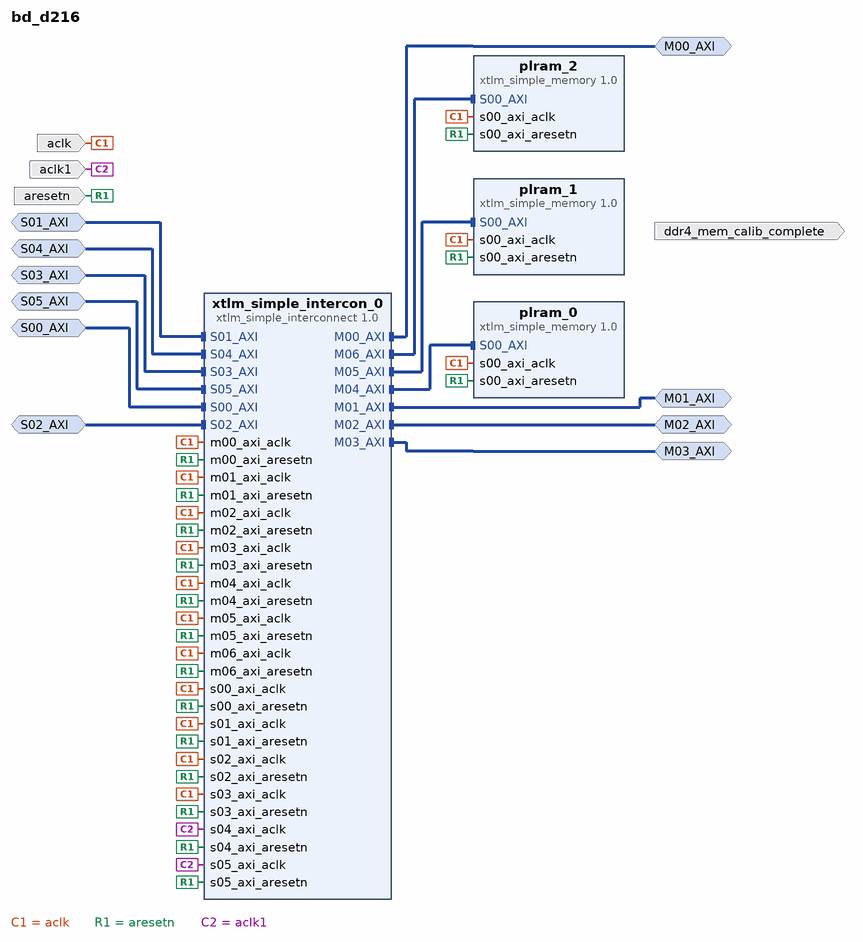
[diagram p0: block diagram of the top level]
# Vivado block design bd_d216, xcvu9p-flgb2104-2-i, Vivado 2019.2
create_bd_design bd_d216

create_bd_intf_port -mode Slave -vlnv xilinx.com:interface:aximm_rtl:1.0 S00_AXI
set_property -dict {CONFIG.ADDR_WIDTH 35} [get_bd_intf_ports S00_AXI]
create_bd_intf_port -mode Slave -vlnv xilinx.com:interface:aximm_rtl:1.0 S01_AXI
set_property -dict {CONFIG.ADDR_WIDTH 35} [get_bd_intf_ports S01_AXI]
create_bd_intf_port -mode Slave -vlnv xilinx.com:interface:aximm_rtl:1.0 S02_AXI
set_property -dict {CONFIG.ADDR_WIDTH 35} [get_bd_intf_ports S02_AXI]
create_bd_intf_port -mode Slave -vlnv xilinx.com:interface:aximm_rtl:1.0 S03_AXI
set_property -dict {CONFIG.ADDR_WIDTH 35} [get_bd_intf_ports S03_AXI]
create_bd_intf_port -mode Slave -vlnv xilinx.com:interface:aximm_rtl:1.0 S04_AXI
set_property -dict {CONFIG.ADDR_WIDTH 35} [get_bd_intf_ports S04_AXI]
create_bd_intf_port -mode Slave -vlnv xilinx.com:interface:aximm_rtl:1.0 S05_AXI
set_property -dict {CONFIG.ADDR_WIDTH 35} [get_bd_intf_ports S05_AXI]
create_bd_intf_port -mode Master -vlnv xilinx.com:interface:aximm_rtl:1.0 M00_AXI
set_property -dict {CONFIG.ADDR_WIDTH 34} [get_bd_intf_ports M00_AXI]
create_bd_intf_port -mode Master -vlnv xilinx.com:interface:aximm_rtl:1.0 M01_AXI
set_property -dict {CONFIG.ADDR_WIDTH 35} [get_bd_intf_ports M01_AXI]
create_bd_intf_port -mode Master -vlnv xilinx.com:interface:aximm_rtl:1.0 M02_AXI
set_property -dict {CONFIG.ADDR_WIDTH 34} [get_bd_intf_ports M02_AXI]
create_bd_intf_port -mode Master -vlnv xilinx.com:interface:aximm_rtl:1.0 M03_AXI
set_property -dict {CONFIG.ADDR_WIDTH 32} [get_bd_intf_ports M03_AXI]
create_bd_port -dir I -type clk aclk
set_property -dict {CONFIG.ASSOCIATED_BUSIF M00_AXI:M01_AXI:M02_AXI:M03_AXI:S00_AXI:S01_AXI:S02_AXI:S03_AXI} [get_bd_ports aclk]
create_bd_port -dir I -type clk aclk1
set_property -dict {CONFIG.ASSOCIATED_BUSIF S04_AXI:S05_AXI} [get_bd_ports aclk1]
create_bd_port -dir I -type rst aresetn
create_bd_port -dir O -type data ddr4_mem_calib_complete

create_bd_cell -type ip -vlnv xilinx.com:xilinx:xtlm_simple_interconnect:1.0 xtlm_simple_intercon_0
set_property -dict [list \
  CONFIG.C_M00_A00_ADDR_RANGE {"0000000000000000000000000000001111111111111111111111111111111111"} \
  CONFIG.C_M00_A00_BASE_ADDRESS 0x0000004000000000 \
  CONFIG.C_M00_AXI_ADDR_WIDTH 34 \
  CONFIG.C_M00_AXI_ARUSER_WIDTH 32 \
  CONFIG.C_M00_AXI_AWUSER_WIDTH 32 \
  CONFIG.C_M00_AXI_BUSER_WIDTH 1 \
  CONFIG.C_M00_AXI_DATA_WIDTH 512 \
  CONFIG.C_M00_AXI_HAS_BRESP true \
  CONFIG.C_M00_AXI_HAS_BURST true \
  CONFIG.C_M00_AXI_HAS_CACHE true \
  CONFIG.C_M00_AXI_HAS_LOCK true \
  CONFIG.C_M00_AXI_HAS_PROT true \
  CONFIG.C_M00_AXI_HAS_QOS true \
  CONFIG.C_M00_AXI_HAS_RRESP true \
  CONFIG.C_M00_AXI_HAS_WSTRB true \
  CONFIG.C_M00_AXI_ID_WIDTH 5 \
  CONFIG.C_M00_AXI_RUSER_WIDTH 1 \
  CONFIG.C_M00_AXI_WUSER_WIDTH 1 \
  CONFIG.C_M01_A00_ADDR_RANGE {"0000000000000000000000000000001111111111111111111111111111111111"} \
  CONFIG.C_M01_A00_BASE_ADDRESS 0x0000000400000000 \
  CONFIG.C_M01_AXI_ADDR_WIDTH 35 \
  CONFIG.C_M01_AXI_ARUSER_WIDTH 0 \
  CONFIG.C_M01_AXI_AWUSER_WIDTH 0 \
  CONFIG.C_M01_AXI_BUSER_WIDTH 0 \
  CONFIG.C_M01_AXI_DATA_WIDTH 512 \
  CONFIG.C_M01_AXI_HAS_BRESP true \
  CONFIG.C_M01_AXI_HAS_BURST true \
  CONFIG.C_M01_AXI_HAS_CACHE false \
  CONFIG.C_M01_AXI_HAS_LOCK false \
  CONFIG.C_M01_AXI_HAS_PROT true \
  CONFIG.C_M01_AXI_HAS_QOS false \
  CONFIG.C_M01_AXI_HAS_RRESP true \
  CONFIG.C_M01_AXI_HAS_WSTRB true \
  CONFIG.C_M01_AXI_ID_WIDTH 0 \
  CONFIG.C_M01_AXI_RUSER_WIDTH 0 \
  CONFIG.C_M01_AXI_WUSER_WIDTH 0 \
  CONFIG.C_M02_A00_ADDR_RANGE {"0000000000000000000000000000001111111111111111111111111111111111"} \
  CONFIG.C_M02_A00_BASE_ADDRESS 0x0000004800000000 \
  CONFIG.C_M02_AXI_ADDR_WIDTH 34 \
  CONFIG.C_M02_AXI_ARUSER_WIDTH 32 \
  CONFIG.C_M02_AXI_AWUSER_WIDTH 32 \
  CONFIG.C_M02_AXI_BUSER_WIDTH 1 \
  CONFIG.C_M02_AXI_DATA_WIDTH 512 \
  CONFIG.C_M02_AXI_HAS_BRESP true \
  CONFIG.C_M02_AXI_HAS_BURST true \
  CONFIG.C_M02_AXI_HAS_CACHE true \
  CONFIG.C_M02_AXI_HAS_LOCK true \
  CONFIG.C_M02_AXI_HAS_PROT true \
  CONFIG.C_M02_AXI_HAS_QOS true \
  CONFIG.C_M02_AXI_HAS_RRESP true \
  CONFIG.C_M02_AXI_HAS_WSTRB true \
  CONFIG.C_M02_AXI_ID_WIDTH 5 \
  CONFIG.C_M02_AXI_RUSER_WIDTH 1 \
  CONFIG.C_M02_AXI_WUSER_WIDTH 1 \
  CONFIG.C_M03_A00_ADDR_RANGE {"0000000000000000000000000000001111111111111111111111111111111111"} \
  CONFIG.C_M03_A00_BASE_ADDRESS 0x0000004C00000000 \
  CONFIG.C_M03_AXI_ADDR_WIDTH 34 \
  CONFIG.C_M03_AXI_ARUSER_WIDTH 32 \
  CONFIG.C_M03_AXI_AWUSER_WIDTH 32 \
  CONFIG.C_M03_AXI_BUSER_WIDTH 1 \
  CONFIG.C_M03_AXI_DATA_WIDTH 512 \
  CONFIG.C_M03_AXI_HAS_BRESP true \
  CONFIG.C_M03_AXI_HAS_BURST true \
  CONFIG.C_M03_AXI_HAS_CACHE true \
  CONFIG.C_M03_AXI_HAS_LOCK true \
  CONFIG.C_M03_AXI_HAS_PROT true \
  CONFIG.C_M03_AXI_HAS_QOS true \
  CONFIG.C_M03_AXI_HAS_RRESP true \
  CONFIG.C_M03_AXI_HAS_WSTRB true \
  CONFIG.C_M03_AXI_ID_WIDTH 5 \
  CONFIG.C_M03_AXI_RUSER_WIDTH 1 \
  CONFIG.C_M03_AXI_WUSER_WIDTH 1 \
  CONFIG.C_M04_A00_ADDR_RANGE 0x0000000000020000 \
  CONFIG.C_M04_A00_BASE_ADDRESS 0x0000005000000000 \
  CONFIG.C_M04_AXI_ADDR_WIDTH 17 \
  CONFIG.C_M04_AXI_DATA_WIDTH 512 \
  CONFIG.C_M05_A00_ADDR_RANGE 0x0000000000020000 \
  CONFIG.C_M05_A00_BASE_ADDRESS 0x0000005000020000 \
  CONFIG.C_M05_AXI_ADDR_WIDTH 17 \
  CONFIG.C_M05_AXI_DATA_WIDTH 512 \
  CONFIG.C_M06_A00_ADDR_RANGE 0x0000000000020000 \
  CONFIG.C_M06_A00_BASE_ADDRESS 0x0000005000040000 \
  CONFIG.C_M06_AXI_ADDR_WIDTH 17 \
  CONFIG.C_M06_AXI_DATA_WIDTH 512 \
  CONFIG.C_NUM_MI 7 \
  CONFIG.C_NUM_SI 6 \
  CONFIG.C_S00_AXI_ADDR_WIDTH 64 \
  CONFIG.C_S00_AXI_ARUSER_WIDTH 1 \
  CONFIG.C_S00_AXI_AWUSER_WIDTH 1 \
  CONFIG.C_S00_AXI_BUSER_WIDTH 1 \
  CONFIG.C_S00_AXI_DATA_WIDTH 32 \
  CONFIG.C_S00_AXI_HAS_BRESP true \
  CONFIG.C_S00_AXI_HAS_BURST true \
  CONFIG.C_S00_AXI_HAS_CACHE true \
  CONFIG.C_S00_AXI_HAS_LOCK true \
  CONFIG.C_S00_AXI_HAS_PROT true \
  CONFIG.C_S00_AXI_HAS_QOS true \
  CONFIG.C_S00_AXI_HAS_REGION false \
  CONFIG.C_S00_AXI_HAS_RRESP true \
  CONFIG.C_S00_AXI_HAS_WSTRB true \
  CONFIG.C_S00_AXI_ID_WIDTH 1 \
  CONFIG.C_S00_AXI_RUSER_WIDTH 1 \
  CONFIG.C_S00_AXI_WUSER_WIDTH 1 \
  CONFIG.C_S01_AXI_ADDR_WIDTH 64 \
  CONFIG.C_S01_AXI_ARUSER_WIDTH 1 \
  CONFIG.C_S01_AXI_AWUSER_WIDTH 1 \
  CONFIG.C_S01_AXI_BUSER_WIDTH 1 \
  CONFIG.C_S01_AXI_DATA_WIDTH 32 \
  CONFIG.C_S01_AXI_HAS_BRESP true \
  CONFIG.C_S01_AXI_HAS_BURST true \
  CONFIG.C_S01_AXI_HAS_CACHE true \
  CONFIG.C_S01_AXI_HAS_LOCK true \
  CONFIG.C_S01_AXI_HAS_PROT true \
  CONFIG.C_S01_AXI_HAS_QOS true \
  CONFIG.C_S01_AXI_HAS_REGION false \
  CONFIG.C_S01_AXI_HAS_RRESP true \
  CONFIG.C_S01_AXI_HAS_WSTRB true \
  CONFIG.C_S01_AXI_ID_WIDTH 1 \
  CONFIG.C_S01_AXI_RUSER_WIDTH 1 \
  CONFIG.C_S01_AXI_WUSER_WIDTH 1 \
  CONFIG.C_S02_AXI_ADDR_WIDTH 64 \
  CONFIG.C_S02_AXI_ARUSER_WIDTH 1 \
  CONFIG.C_S02_AXI_AWUSER_WIDTH 1 \
  CONFIG.C_S02_AXI_BUSER_WIDTH 1 \
  CONFIG.C_S02_AXI_DATA_WIDTH 32 \
  CONFIG.C_S02_AXI_HAS_BRESP true \
  CONFIG.C_S02_AXI_HAS_BURST true \
  CONFIG.C_S02_AXI_HAS_CACHE true \
  CONFIG.C_S02_AXI_HAS_LOCK true \
  CONFIG.C_S02_AXI_HAS_PROT true \
  CONFIG.C_S02_AXI_HAS_QOS true \
  CONFIG.C_S02_AXI_HAS_REGION false \
  CONFIG.C_S02_AXI_HAS_RRESP true \
  CONFIG.C_S02_AXI_HAS_WSTRB true \
  CONFIG.C_S02_AXI_ID_WIDTH 1 \
  CONFIG.C_S02_AXI_RUSER_WIDTH 1 \
  CONFIG.C_S02_AXI_WUSER_WIDTH 1 \
  CONFIG.C_S03_AXI_ADDR_WIDTH 64 \
  CONFIG.C_S03_AXI_ARUSER_WIDTH 1 \
  CONFIG.C_S03_AXI_AWUSER_WIDTH 1 \
  CONFIG.C_S03_AXI_BUSER_WIDTH 1 \
  CONFIG.C_S03_AXI_DATA_WIDTH 32 \
  CONFIG.C_S03_AXI_HAS_BRESP true \
  CONFIG.C_S03_AXI_HAS_BURST true \
  CONFIG.C_S03_AXI_HAS_CACHE true \
  CONFIG.C_S03_AXI_HAS_LOCK true \
  CONFIG.C_S03_AXI_HAS_PROT true \
  CONFIG.C_S03_AXI_HAS_QOS true \
  CONFIG.C_S03_AXI_HAS_REGION false \
  CONFIG.C_S03_AXI_HAS_RRESP true \
  CONFIG.C_S03_AXI_HAS_WSTRB true \
  CONFIG.C_S03_AXI_ID_WIDTH 1 \
  CONFIG.C_S03_AXI_RUSER_WIDTH 1 \
  CONFIG.C_S03_AXI_WUSER_WIDTH 1 \
  CONFIG.C_S04_AXI_ADDR_WIDTH 64 \
  CONFIG.C_S04_AXI_ARUSER_WIDTH 0 \
  CONFIG.C_S04_AXI_AWUSER_WIDTH 0 \
  CONFIG.C_S04_AXI_BUSER_WIDTH 0 \
  CONFIG.C_S04_AXI_DATA_WIDTH 32 \
  CONFIG.C_S04_AXI_HAS_BRESP true \
  CONFIG.C_S04_AXI_HAS_BURST false \
  CONFIG.C_S04_AXI_HAS_CACHE true \
  CONFIG.C_S04_AXI_HAS_LOCK true \
  CONFIG.C_S04_AXI_HAS_PROT true \
  CONFIG.C_S04_AXI_HAS_QOS true \
  CONFIG.C_S04_AXI_HAS_REGION true \
  CONFIG.C_S04_AXI_HAS_RRESP true \
  CONFIG.C_S04_AXI_HAS_WSTRB true \
  CONFIG.C_S04_AXI_ID_WIDTH 0 \
  CONFIG.C_S04_AXI_RUSER_WIDTH 0 \
  CONFIG.C_S04_AXI_WUSER_WIDTH 0 \
  CONFIG.C_S05_AXI_ADDR_WIDTH 64 \
  CONFIG.C_S05_AXI_ARUSER_WIDTH 0 \
  CONFIG.C_S05_AXI_AWUSER_WIDTH 0 \
  CONFIG.C_S05_AXI_BUSER_WIDTH 0 \
  CONFIG.C_S05_AXI_DATA_WIDTH 32 \
  CONFIG.C_S05_AXI_HAS_BRESP true \
  CONFIG.C_S05_AXI_HAS_BURST false \
  CONFIG.C_S05_AXI_HAS_CACHE true \
  CONFIG.C_S05_AXI_HAS_LOCK true \
  CONFIG.C_S05_AXI_HAS_PROT true \
  CONFIG.C_S05_AXI_HAS_QOS true \
  CONFIG.C_S05_AXI_HAS_REGION true \
  CONFIG.C_S05_AXI_HAS_RRESP true \
  CONFIG.C_S05_AXI_HAS_WSTRB true \
  CONFIG.C_S05_AXI_ID_WIDTH 0 \
  CONFIG.C_S05_AXI_RUSER_WIDTH 0 \
  CONFIG.C_S05_AXI_WUSER_WIDTH 0 \
] [get_bd_cells xtlm_simple_intercon_0]
create_bd_cell -type ip -vlnv xilinx.com:xilinx:xtlm_simple_memory:1.0 plram_0
set_property -dict [list \
  CONFIG.C_MEM_SIZE 0x0000000000020000 \
  CONFIG.C_S00_AXI_ADDR_WIDTH 64 \
  CONFIG.C_S00_AXI_DATA_WIDTH 512 \
] [get_bd_cells plram_0]
create_bd_cell -type ip -vlnv xilinx.com:xilinx:xtlm_simple_memory:1.0 plram_1
set_property -dict [list \
  CONFIG.C_MEM_SIZE 0x0000000000020000 \
  CONFIG.C_S00_AXI_ADDR_WIDTH 64 \
  CONFIG.C_S00_AXI_DATA_WIDTH 512 \
] [get_bd_cells plram_1]
create_bd_cell -type ip -vlnv xilinx.com:xilinx:xtlm_simple_memory:1.0 plram_2
set_property -dict [list \
  CONFIG.C_MEM_SIZE 0x0000000000020000 \
  CONFIG.C_S00_AXI_ADDR_WIDTH 64 \
  CONFIG.C_S00_AXI_DATA_WIDTH 512 \
] [get_bd_cells plram_2]

# ---- connections ----

connect_bd_intf_net [get_bd_intf_ports S01_AXI] [get_bd_intf_pins xtlm_simple_intercon_0/S01_AXI]
connect_bd_intf_net [get_bd_intf_ports M00_AXI] [get_bd_intf_pins xtlm_simple_intercon_0/M00_AXI]
connect_bd_intf_net [get_bd_intf_ports S04_AXI] [get_bd_intf_pins xtlm_simple_intercon_0/S04_AXI]
connect_bd_intf_net [get_bd_intf_pins plram_1/S00_AXI] [get_bd_intf_pins xtlm_simple_intercon_0/M05_AXI]
connect_bd_intf_net [get_bd_intf_ports S03_AXI] [get_bd_intf_pins xtlm_simple_intercon_0/S03_AXI]
connect_bd_intf_net [get_bd_intf_ports S05_AXI] [get_bd_intf_pins xtlm_simple_intercon_0/S05_AXI]
connect_bd_intf_net [get_bd_intf_ports M03_AXI] [get_bd_intf_pins xtlm_simple_intercon_0/M03_AXI]
connect_bd_intf_net [get_bd_intf_ports M02_AXI] [get_bd_intf_pins xtlm_simple_intercon_0/M02_AXI]
connect_bd_intf_net [get_bd_intf_ports S00_AXI] [get_bd_intf_pins xtlm_simple_intercon_0/S00_AXI]
connect_bd_intf_net [get_bd_intf_pins plram_0/S00_AXI] [get_bd_intf_pins xtlm_simple_intercon_0/M04_AXI]
connect_bd_intf_net [get_bd_intf_pins plram_2/S00_AXI] [get_bd_intf_pins xtlm_simple_intercon_0/M06_AXI]
connect_bd_intf_net [get_bd_intf_ports S02_AXI] [get_bd_intf_pins xtlm_simple_intercon_0/S02_AXI]
connect_bd_intf_net [get_bd_intf_ports M01_AXI] [get_bd_intf_pins xtlm_simple_intercon_0/M01_AXI]
connect_bd_net [get_bd_ports aclk] \
  [get_bd_pins xtlm_simple_intercon_0/s00_axi_aclk] [get_bd_pins xtlm_simple_intercon_0/s01_axi_aclk] \
  [get_bd_pins xtlm_simple_intercon_0/s02_axi_aclk] [get_bd_pins xtlm_simple_intercon_0/s03_axi_aclk] \
  [get_bd_pins xtlm_simple_intercon_0/m00_axi_aclk] [get_bd_pins xtlm_simple_intercon_0/m01_axi_aclk] \
  [get_bd_pins xtlm_simple_intercon_0/m02_axi_aclk] [get_bd_pins xtlm_simple_intercon_0/m03_axi_aclk] \
  [get_bd_pins plram_0/s00_axi_aclk] [get_bd_pins xtlm_simple_intercon_0/m04_axi_aclk] [get_bd_pins plram_1/s00_axi_aclk] \
  [get_bd_pins xtlm_simple_intercon_0/m05_axi_aclk] [get_bd_pins plram_2/s00_axi_aclk] \
  [get_bd_pins xtlm_simple_intercon_0/m06_axi_aclk]
connect_bd_net [get_bd_ports aresetn] \
  [get_bd_pins xtlm_simple_intercon_0/s00_axi_aresetn] [get_bd_pins xtlm_simple_intercon_0/s01_axi_aresetn] \
  [get_bd_pins xtlm_simple_intercon_0/s02_axi_aresetn] [get_bd_pins xtlm_simple_intercon_0/s03_axi_aresetn] \
  [get_bd_pins xtlm_simple_intercon_0/s04_axi_aresetn] [get_bd_pins xtlm_simple_intercon_0/s05_axi_aresetn] \
  [get_bd_pins xtlm_simple_intercon_0/m00_axi_aresetn] [get_bd_pins xtlm_simple_intercon_0/m01_axi_aresetn] \
  [get_bd_pins xtlm_simple_intercon_0/m02_axi_aresetn] [get_bd_pins xtlm_simple_intercon_0/m03_axi_aresetn] \
  [get_bd_pins plram_0/s00_axi_aresetn] [get_bd_pins xtlm_simple_intercon_0/m04_axi_aresetn] \
  [get_bd_pins plram_1/s00_axi_aresetn] [get_bd_pins xtlm_simple_intercon_0/m05_axi_aresetn] \
  [get_bd_pins plram_2/s00_axi_aresetn] [get_bd_pins xtlm_simple_intercon_0/m06_axi_aresetn]
connect_bd_net -net aclk1_1 [get_bd_ports aclk1] [get_bd_pins xtlm_simple_intercon_0/s04_axi_aclk] [get_bd_pins xtlm_simple_intercon_0/s05_axi_aclk]

# ---- address map ----
assign_bd_address -offset 0x000000000 -range 4G -target_address_space [get_bd_addr_spaces S00_AXI] [get_bd_addr_segs M03_AXI/Reg]
assign_bd_address -offset 0x400000000 -range 64K -target_address_space [get_bd_addr_spaces S00_AXI] [get_bd_addr_segs M01_AXI/Reg]
assign_bd_address -offset 0x000000000 -range 4G -target_address_space [get_bd_addr_spaces S01_AXI] [get_bd_addr_segs M03_AXI/Reg]
assign_bd_address -offset 0x400000000 -range 64K -target_address_space [get_bd_addr_spaces S01_AXI] [get_bd_addr_segs M01_AXI/Reg]
assign_bd_address -offset 0x000000000 -range 4G -target_address_space [get_bd_addr_spaces S02_AXI] [get_bd_addr_segs M03_AXI/Reg]
assign_bd_address -offset 0x400000000 -range 64K -target_address_space [get_bd_addr_spaces S02_AXI] [get_bd_addr_segs M01_AXI/Reg]
assign_bd_address -offset 0x000000000 -range 4G -target_address_space [get_bd_addr_spaces S03_AXI] [get_bd_addr_segs M03_AXI/Reg]
assign_bd_address -offset 0x400000000 -range 64K -target_address_space [get_bd_addr_spaces S03_AXI] [get_bd_addr_segs M01_AXI/Reg]
assign_bd_address -offset 0x000000000 -range 4G -target_address_space [get_bd_addr_spaces S04_AXI] [get_bd_addr_segs M03_AXI/Reg]
assign_bd_address -offset 0x400000000 -range 64K -target_address_space [get_bd_addr_spaces S04_AXI] [get_bd_addr_segs M01_AXI/Reg]
assign_bd_address -offset 0x000000000 -range 4G -target_address_space [get_bd_addr_spaces S05_AXI] [get_bd_addr_segs M03_AXI/Reg]
assign_bd_address -offset 0x400000000 -range 64K -target_address_space [get_bd_addr_spaces S05_AXI] [get_bd_addr_segs M01_AXI/Reg]

validate_bd_design
save_bd_design
